# Altium schematic sheet SENSOR.SchDoc
size A4
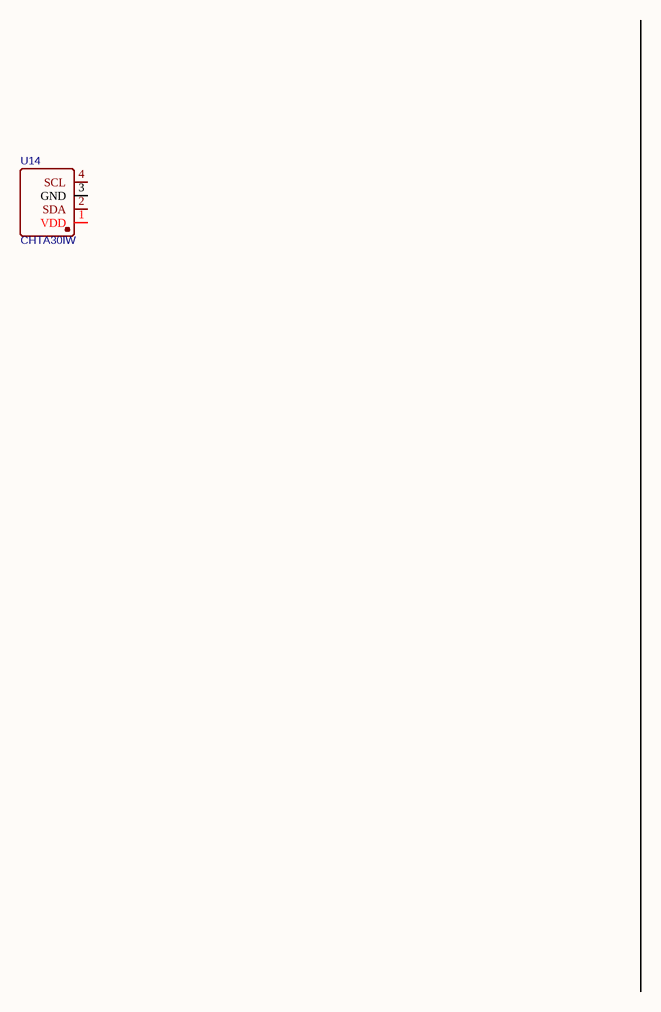
[diagram p0: SENSOR.SchDoc]

## Parts
U14  CHTA30IW  [SENSOR-TH_CHTA30IW]

## Nets

Not connected (* = marked no-connect by the designer): U14 1(VDD) 2(SDA) 3(GND) 4(SCL)

## Library data of the parts
U14 = CHTA30IW: BOM_Manufacturer: CYBERSEN; Contributor: LCSC; BOM_Supplier: LCSC; BOM_Supplier Part: C393714; BOM_Manufacturer Part: CHTA30IW; BOM_JLCPCB Part Class: Extended Part; spicePre: U; spiceSymbolName: CHTA30IW